# Altium schematic sheet RemoteControl.SchDoc
size A3; SheetNumber: 1; SheetTotal: 1
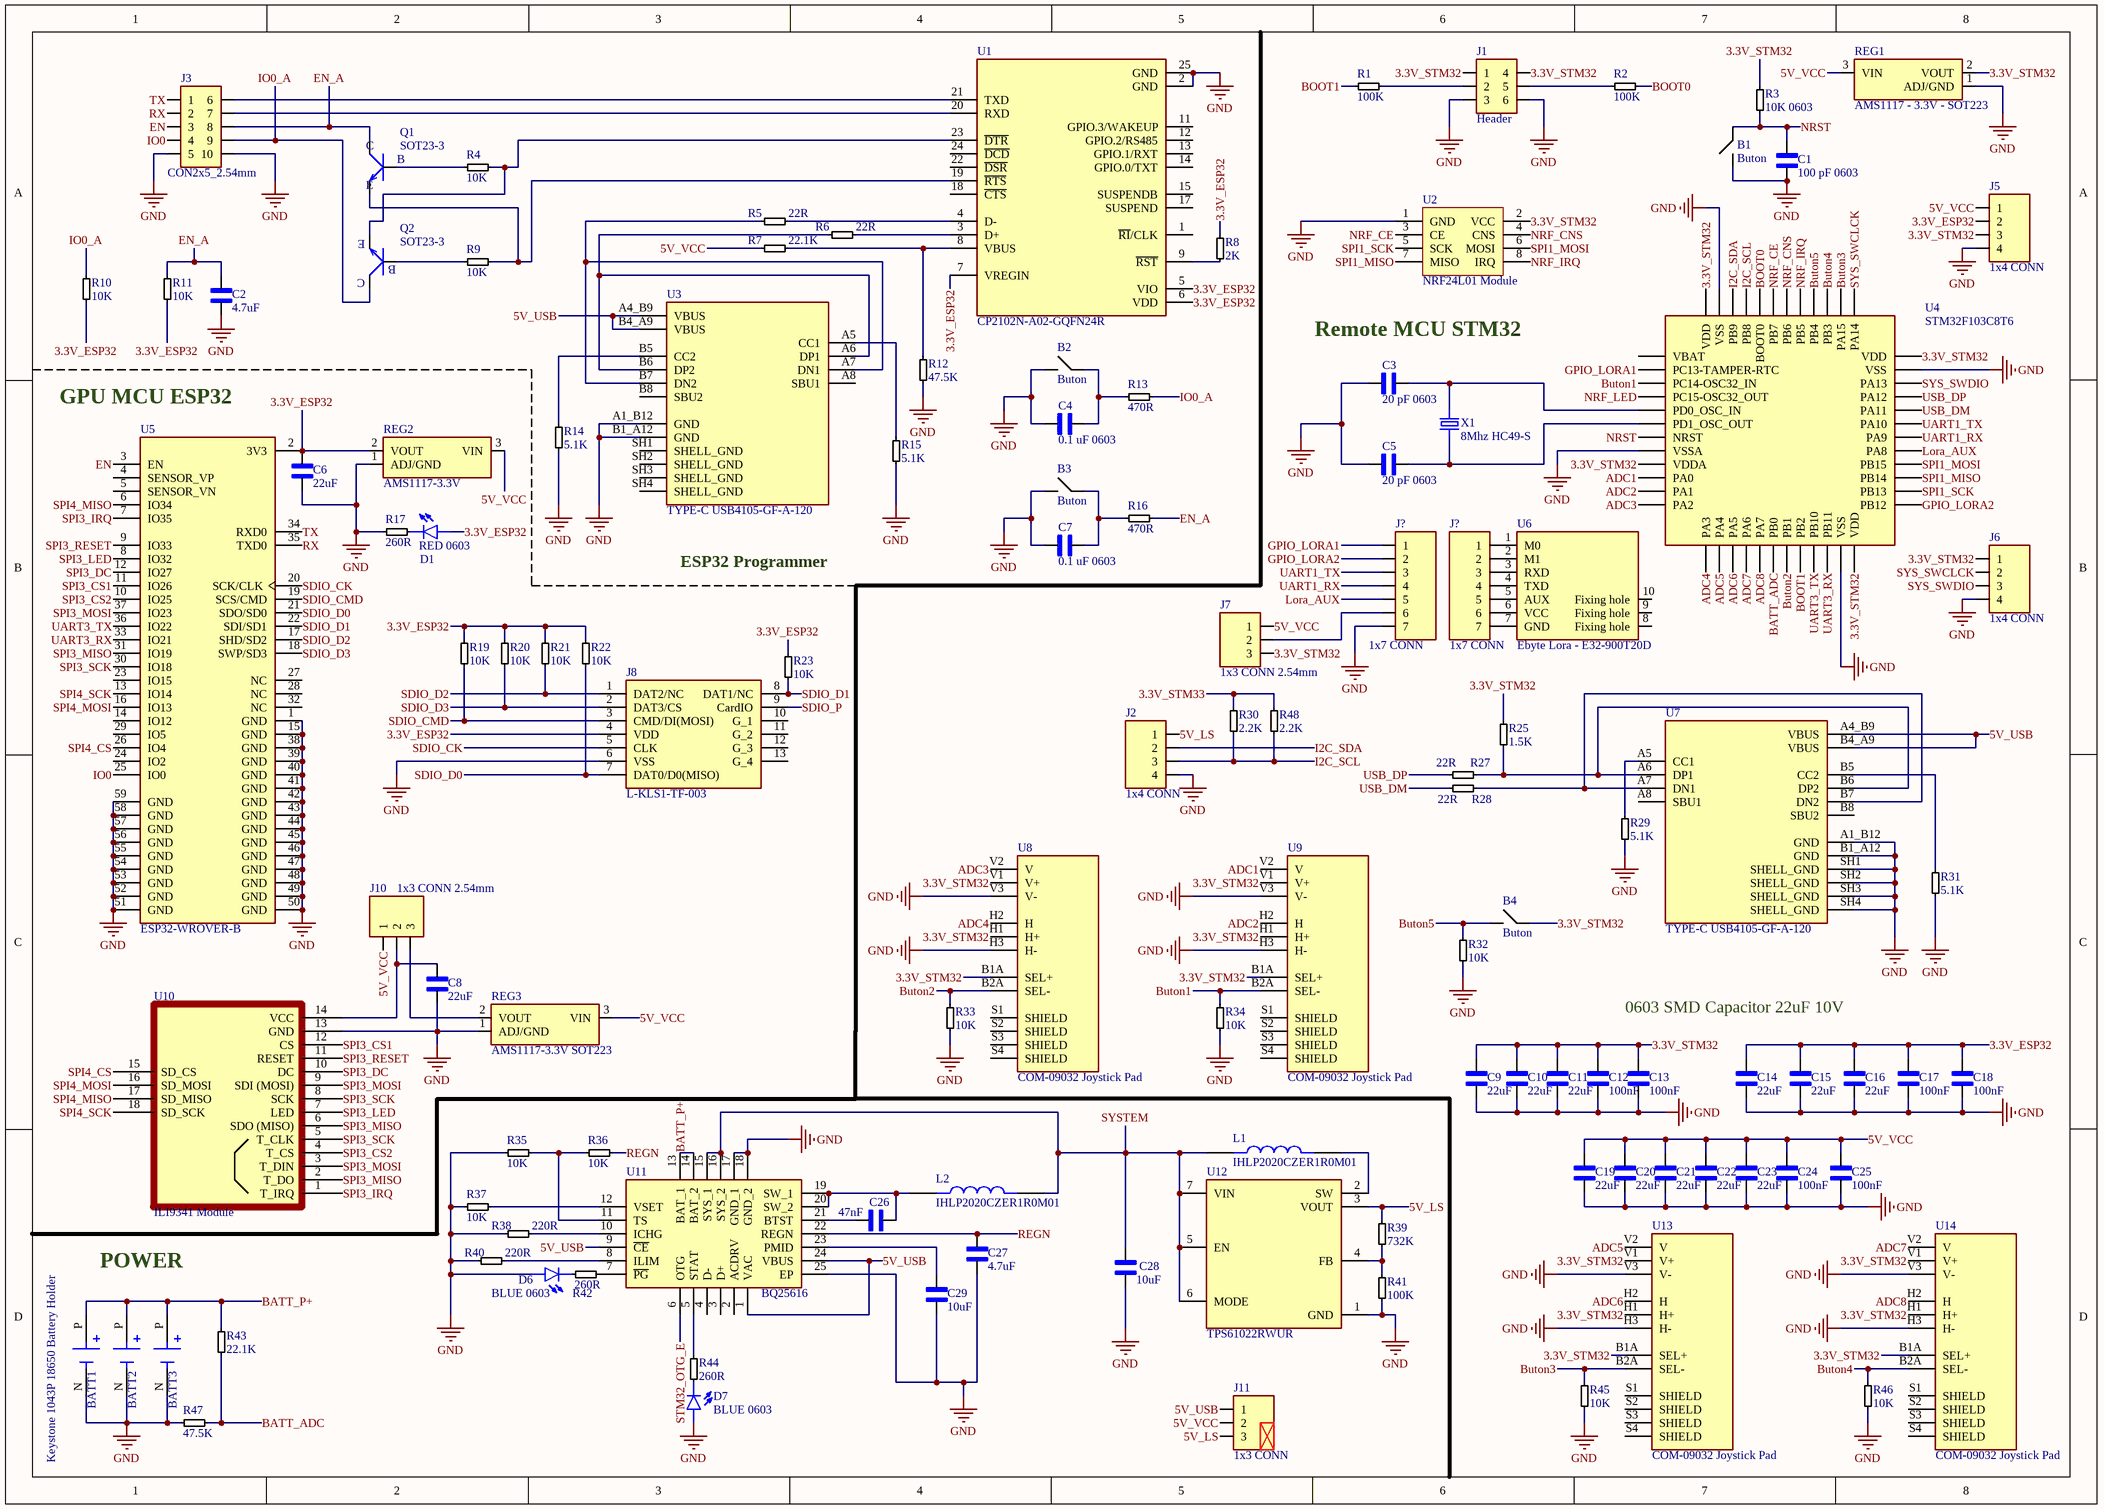
[diagram p0: RemoteControl.SchDoc]

## Parts
(Parts that share a designator on the sheet are numbered #1, #2 ... from top to bottom, then left to right.)
B1  Buton  [SMD TACT SWITCH BUTTON]
B2  Buton  [SMD TACT SWITCH BUTTON]
B3  Buton  [SMD TACT SWITCH BUTTON]
B4  Buton  [SMD TACT SWITCH BUTTON]
BATT1  Keystone 1043P 18650 Battery Holder  [1043P]
BATT2  Keystone 1043P 18650 Battery Holder  [1043P]  (value not drawn)
BATT3  Keystone 1043P 18650 Battery Holder  [1043P]  (value not drawn)
C1  100 pF 0603  [0603 SMD CAP]
C2  4.7uF  [0603 SMD CAP]
C3  20 pF 0603  [0603 SMD CAP]
C4  0.1 uF 0603  [0603 SMD CAP]
C5  20 pF 0603  [0603 SMD CAP]
C6  22uF  [0603 SMD CAP]
C7  0.1 uF 0603  [0603 SMD CAP]
C8  22uF  [0603 SMD CAP]
C9  22uF  [0603 SMD CAP]
C10  22uF  [0603 SMD CAP]
C11  22uF  [0603 SMD CAP]
C12  100nF  [0603 SMD CAP]
C13  100nF  [0603 SMD CAP]
C14  22uF  [0603 SMD CAP]
C15  22uF  [0603 SMD CAP]
C16  22uF  [0603 SMD CAP]
C17  100nF  [0603 SMD CAP]
C18  100nF  [0603 SMD CAP]
C19  22uF  [0603 SMD CAP]
C20  22uF  [0603 SMD CAP]
C21  22uF  [0603 SMD CAP]
C22  22uF  [0603 SMD CAP]
C23  22uF  [0603 SMD CAP]
C24  100nF  [0603 SMD CAP]
C25  100nF  [0603 SMD CAP]
C26  47nF  [0603 SMD CAP]
C27  4.7uF  [0603 SMD CAP]
C28  10uF  [0603 SMD CAP]
C29  10uF  [0603 SMD CAP]
D1  RED 0603  [0603 SMD LED]
D6  BLUE 0603  [0603 SMD LED]
D7  BLUE 0603  [0603 SMD LED]
J1  Header  [CON2x3_2.54MM]
J2  1x4 CONN  [CON1x4_2.54MM]
J3  CON2x5_2.54mm  [CON2x5_2.54MM]
J5  1x4 CONN  [CON1x4_2.54MM]
J6  1x4 CONN  [CON1x4_2.54MM]
J7  1x3 CONN 2.54mm  [CON1x3_2.54MM]
J8  L-KLS1-TF-003  [L-KLS1-TF-003-H1.85-R]
J10  1x3 CONN 2.54mm  [CON1x3_2.54MM]
J11  1x3 CONN  [CON1x3_2.54MM]
J?#1  1x7 CONN  [CON1x7_2.54MM]
J?#2  1x7 CONN  [CON1x7_2.54MM]
L1  IHLP2020CZER1R0M01  [IHLP2020CZER1R0M01]
L2  IHLP2020CZER1R0M01  [IHLP2020CZER1R0M01]
Q1  SOT23-3  [SOT23]
Q2  SOT23-3  [SOT23]
R1  100K  [0603 SMD RES]
R2  100K  [0603 SMD RES]
R3  10K 0603  [0603 SMD RES]
R4  10K  [0603 SMD RES]
R5  22R  [0603 SMD RES]
R6  22R  [0603 SMD RES]
R7  22.1K  [0603 SMD RES]
R8  2K  [0603 SMD RES]
R9  10K  [0603 SMD RES]
R10  10K  [0603 SMD RES]
R11  10K  [0603 SMD RES]
R12  47.5K  [0603 SMD RES]
R13  470R  [0603 SMD RES]
R14  5.1K  [0603 SMD RES]
R15  5.1K  [0603 SMD RES]
R16  470R  [0603 SMD RES]
R17  260R  [0603 SMD RES]
R19  10K  [0603 SMD RES]
R20  10K  [0603 SMD RES]
R21  10K  [0603 SMD RES]
R22  10K  [0603 SMD RES]
R23  10K  [0603 SMD RES]
R25  1.5K  [0603 SMD RES]
R27  22R  [0603 SMD RES]
R28  22R  [0603 SMD RES]
R29  5.1K  [0603 SMD RES]
R30  2.2K  [0603 SMD RES]
R31  5.1K  [0603 SMD RES]
R32  10K  [0603 SMD RES]
R33  10K  [0603 SMD RES]
R34  10K  [0603 SMD RES]
R35  10K  [0603 SMD RES]
R36  10K  [0603 SMD RES]
R37  10K  [0603 SMD RES]
R38  220R  [0603 SMD RES]
R39  732K  [0603 SMD RES]
R40  220R  [0603 SMD RES]
R41  100K  [0603 SMD RES]
R42  260R  [0603 SMD RES]
R43  22.1K  [0603 SMD RES]
R44  260R  [0603 SMD RES]
R45  10K  [0603 SMD RES]
R46  10K  [0603 SMD RES]
R47  47.5K  [0603 SMD RES]
R48  2.2K  [0603 SMD RES]
REG1  AMS1117 - 3.3V - SOT223  [SOT-223]
REG2  AMS1117-3.3V  [SOT-223]
REG3  AMS1117-3.3V SOT223  [SOT-223]
U1  CP2102N-A02-GQFN24R  [CP2102N-A02-GQFN24R]
U2  NRF24L01 Module  [NRF24L01 MODULE]
U3  TYPE-C USB4105-GF-A-120  [TYPE-C USB4105-GF-A-120]
U4  STM32F103C8T6  [LQFP-48]
U5  ESP32-WROVER-B  [ESP32-WROVER-B]
U6  Ebyte Lora - E32-900T20D  [Ebyte LoRa Modul]
U7  TYPE-C USB4105-GF-A-120  [TYPE-C USB4105-GF-A-120]
U8  COM-09032 Joystick Pad  [XDCR_COM-09032]
U9  COM-09032 Joystick Pad  [XDCR_COM-09032]
U10  ILI9341 Module  [ILI9341 2.8" Pitch]
U11  BQ25616  [WQFN-24]
U12  TPS61022RWUR  [TPS61022RWUR]
U13  COM-09032 Joystick Pad  [XDCR_COM-09032]
U14  COM-09032 Joystick Pad  [XDCR_COM-09032]
X1  8Mhz HC49-S  [HC49-S Crystal Oscillator]

## Nets
GND: B1.0 B2.0 B3.0 BATT1.N(NEG) BATT2.N(NEG) BATT3.N(NEG) C1.2 C2.2 C3.2 C4.2 C5.2 C6.2 C7.2 C8.2 C9.2 C10.2 C11.2 C12.2 C13.2 C14.2 C15.2 C16.2 C17.2 C18.2 C19.2 C20.2 C21.2 C22.2 C23.2 C24.2 C25.2 C27.2 C28.2 C29.1 D6.A D7.A J1.3 J1.6 J2.4 J3.5 J3.10 J5.4 J6.4 J8.6(VSS) J?#1.7 R12.1 R14.1 R15.1 R17.2 R29.1 R31.1 R32.1 R33.2 R34.2 R35.2 R37.2 R38.1 R40.1 R41.2 R45.2 R46.2 R47.2 REG1.1(ADJ/GND) REG2.1(ADJ/GND) REG3.1(ADJ/GND) U1.2(GND) U1.25(GND) U2.1(GND) U3.A1_B12(GND) U3.B1_A12(GND) U4.8(VSSA) U4.23(VSS) U4.35(VSS) U4.47(VSS) U5.1(GND) U5.15(GND) U5.38(GND) U5.39(GND) U5.40(GND) U5.41(GND) U5.42(GND) U5.43(GND) U5.44(GND) U5.45(GND) U5.46(GND) U5.47(GND) U5.48(GND) U5.49(GND) U5.50(GND) U5.51(GND) U5.52(GND) U5.53(GND) U5.54(GND) U5.55(GND) U5.56(GND) U5.57(GND) U5.58(GND) U5.59(GND) U7.A1_B12(GND) U7.B1_A12(GND) U7.SH1(SHELL_GND) U7.SH2(SHELL_GND) U7.SH3(SHELL_GND) U7.SH4(SHELL_GND) U8.H3(H-) U8.V3(V-) U9.H3(H-) U9.V3(V-) U10.13(GND) U11.17(GND_1) U11.18(GND_2) U11.25(EP) U12.1(GND) U13.H3(H-) U13.V3(V-) U14.H3(H-) U14.V3(V-)
3.3V_ESP32: C6.1 C14.1 C15.1 C16.1 C17.1 C18.1 D1.A J5.2 J8.4(VDD) R8.2 R10.1 R11.1 R19.2 R20.2 R21.2 R22.2 R23.1 REG2.2(VOUT) U1.5(VIO) U1.6(VDD) U1.7(VREGIN) U5.2(3V3)
3.3V_STM32: B4.1 C9.1 C10.1 C11.1 C12.1 C13.1 J1.1 J1.4 J5.3 J6.1 J7.3 R3.1 R25.2 REG1.2(VOUT) U2.2(VCC) U4.9(VDDA) U4.24(VDD) U4.36(VDD) U4.48(VDD) U8.B1A(SEL+) U8.H1(H+) U8.V1(V+) U9.B1A(SEL+) U9.H1(H+) U9.V1(V+) U13.B1A(SEL+) U13.H1(H+) U13.V1(V+) U14.B1A(SEL+) U14.H1(H+) U14.V1(V+)
3.3V_STM33: R30.2 R48.2
5V_LS: J2.1 J11.3 R39.1 U12.3(VOUT)
5V_USB: J11.1 U3.A4_B9(VBUS) U3.B4_A9(VBUS) U7.A4_B9(VBUS) U7.B4_A9(VBUS) U11.1(VAC) U11.9(~{CE}) U11.24(VBUS)
5V_VCC: C19.1 C20.1 C21.1 C22.1 C23.1 C24.1 C25.1 J5.1 J7.1 J10.1 J11.2 R7.1 REG1.3(VIN) REG2.3(VIN) REG3.3(VIN)
ADC1: U4.10(PA0) U9.V2(V)
ADC2: U4.11(PA1) U9.H2(H)
ADC3: U4.12(PA2) U8.V2(V)
ADC4: U4.13(PA3) U8.H2(H)
ADC5: U4.14(PA4) U13.V2(V)
ADC6: U4.15(PA5) U13.H2(H)
ADC7: U4.16(PA6) U14.V2(V)
ADC8: U4.17(PA7) U14.H2(H)
BATT_ADC: R43.1 R47.1 U4.18(PB0)
BATT_P+: BATT1.P(POS) BATT2.P(POS) BATT3.P(POS) R43.2 U11.13(BAT_1) U11.14(BAT_2)
BOOT0: R2.2 U4.44(BOOT0)
BOOT1: R1.1 U4.20(PB2)
Buton1: R34.1 U4.3(PC14-OSC32_IN) U9.B2A(SEL-)
Buton2: R33.1 U4.19(PB1) U8.B2A(SEL-)
Buton3: R45.1 U4.38(PA15) U13.B2A(SEL-)
Buton4: R46.1 U4.39(PB3) U14.B2A(SEL-)
Buton5: B4.0 R32.2 U4.40(PB4)
EN: J3.3 U5.3(EN)
EN_A: C2.1 J3.8 Q1.3(C) R11.2 R16.2
GPIO_LORA1: J?#1.1 U4.2(PC13-TAMPER-RTC)
GPIO_LORA2: J?#1.2 U4.25(PB12)
I2C_SCL: J2.3 R30.1 R48.1 U4.45(PB8)
I2C_SDA: J2.2 U4.46(PB9)
IO0: J3.4 U5.25(IO0)
IO0_A: J3.9 Q2.3(C) R10.2 R13.2
Lora_AUX: J?#1.5 U4.29(PA8)
NRF_CE: U2.3(CE) U4.43(PB7)
NRF_CNS: U2.4(CNS) U4.42(PB6)
NRF_IRQ: U2.8(IRQ) U4.41(PB5)
NRF_LED: U4.4(PC15-OSC32_OUT)
NRST: B1.1 C1.1 R3.2 U4.7(NRST)
REGN: C27.1 R36.2 U11.22(REGN)
RX: J3.2 U5.35(TXD0)
SDIO_CK: J8.5(CLK) U5.20(SCK/CLK)
SDIO_CMD: J8.3(CMD/DI(MOSI)) R19.1 U5.19(SCS/CMD)
SDIO_D0: J8.7(DAT0/D0(MISO)) R22.1 U5.21(SDO/SD0)
SDIO_D1: J8.8(DAT1/NC) R23.2 U5.22(SDI/SD1)
SDIO_D2: J8.1(DAT2/NC) R21.1 U5.17(SHD/SD2)
SDIO_D3: J8.2(DAT3/CS) R20.1 U5.18(SWP/SD3)
SDIO_P: J8.9(CardIO)
SPI1_MISO: U2.7(MISO) U4.27(PB14)
SPI1_MOSI: U2.6(MOSI) U4.28(PB15)
SPI1_SCK: U2.5(SCK) U4.26(PB13)
SPI3_CS1: U5.11(IO26) U10.12(CS)
SPI3_CS2: U5.10(IO25) U10.4(T_CS)
SPI3_DC: U5.12(IO27) U10.10(DC)
SPI3_IRQ: U5.7(IO35) U10.1(T_IRQ)
SPI3_LED: U5.8(IO32) U10.7(LED)
SPI3_MISO: U5.31(IO19) U10.2(T_DO) U10.6(SDO_(MISO))
SPI3_MOSI: U5.37(IO23) U10.3(T_DIN) U10.9(SDI_(MOSI))
SPI3_RESET: U5.9(IO33) U10.11(RESET)
SPI3_SCK: U5.30(IO18) U10.5(T_CLK) U10.8(SCK)
SPI4_CS: U5.26(IO4) U10.15(SD_CS)
SPI4_MISO: U5.6(IO34) U10.17(SD_MISO)
SPI4_MOSI: U5.16(IO13) U10.16(SD_MOSI)
SPI4_SCK: U5.13(IO14) U10.18(SD_SCK)
STM32_OTG_E: U11.6(OTG)
SYS_SWCLCK: J6.2 U4.37(PA14)
SYS_SWDIO: J6.3 U4.34(PA13)
SYSTEM: C28.1 L1.1 L2.2 U11.15(SYS_1) U11.16(SYS_2) U12.5(EN) U12.6(MODE) U12.7(VIN)
TX: J3.1 U5.34(RXD0)
UART1_RX: J?#1.4 U4.30(PA9)
UART1_TX: J?#1.3 U4.31(PA10)
UART3_RX: U4.22(PB11) U5.33(IO21)
UART3_TX: U4.21(PB10) U5.36(IO22)
USB_DM: R28.1 U4.32(PA11)
USB_DP: R27.1 U4.33(PA12)
NetB2_1: B2.1 C4.1 R13.1
NetB3_1: B3.1 C7.1 R16.1
NetC3_1: C3.1 U4.5(PD0_OSC_IN) X1.2
NetC5_1: C5.1 U4.6(PD1_OSC_OUT) X1.1
NetC8_1: C8.1 J10.2 U10.14(VCC)
NetC26_1: C26.1 U11.21(BTST)
NetC26_2: C26.2 L2.1 U11.19(SW_1) U11.20(SW_2)
NetC29_2: C29.2 U11.23(PMID)
NetD1_C: D1.C R17.1
NetD6_C: D6.C R42.1
NetD7_C: D7.C R44.1
NetJ1_2: J1.2 R1.2
NetJ1_5: J1.5 R2.1
NetJ3_6: J3.6 U1.21(TXD)
NetJ3_7: J3.7 U1.20(RXD)
NetJ7_2: J7.2 J?#1.6
NetJ10_3: J10.3 REG3.2(VOUT)
NetJ?#2_1: J?#2.1 U6.1(M0)
NetJ?#2_2: J?#2.2 U6.2(M1)
NetJ?#2_3: J?#2.3 U6.3(RXD)
NetJ?#2_4: J?#2.4 U6.4(TXD)
NetJ?#2_5: J?#2.5 U6.5(AUX)
NetJ?#2_6: J?#2.6 U6.6(VCC)
NetJ?#2_7: J?#2.7 U6.7(GND)
NetL1_2: L1.2 U12.2(SW)
NetQ1_1: Q1.1(B) R4.1
NetQ1_2: Q1.2(E) R9.2 U1.19(~{RTS})
NetQ2_1: Q2.1(B) R9.1
NetQ2_2: Q2.2(E) R4.2 U1.23(~{DTR})
NetR5_1: R5.1 U3.A7(DN1) U3.B7(DN2)
NetR5_2: R5.2 U1.4(D-)
NetR6_1: R6.1 U3.A6(DP1) U3.B6(DP2)
NetR6_2: R6.2 U1.3(D+)
NetR7_2: R7.2 R12.2 U1.8(VBUS)
NetR8_1: R8.1 U1.9(~{RST})
NetR14_2: R14.2 U3.B5(CC2)
NetR15_2: R15.2 U3.A5(CC1)
NetR25_1: R25.1 R27.2 U7.A6(DP1) U7.B6(DP2)
NetR28_2: R28.2 U7.A7(DN1) U7.B7(DN2)
NetR29_2: R29.2 U7.A5(CC1)
NetR31_2: R31.2 U7.B5(CC2)
NetR35_1: R35.1 R36.1 U11.11(TS)
NetR37_1: R37.1 U11.12(VSET)
NetR38_2: R38.2 U11.10(ICHG)
NetR39_2: R39.2 R41.1 U12.4(FB)
NetR40_2: R40.2 U11.8(ILIM)
NetR42_2: R42.2 U11.7(~{PG})
NetR44_2: R44.2 U11.5(STAT)

Not connected (* = marked no-connect by the designer): J8 10(G_1) 11(G_2) 12(G_3) 13(G_4); U1 1(~{RI}/CLK) 11(GPIO.3/WAKEUP) 12(GPIO.2/RS485) 13(GPIO.1/RXT) 14(GPIO.0/TXT) 15(SUSPENDB) 17(SUSPEND) 18(~{CTS}) 22(~{DSR}) 24(~{DCD}); U3 A8(SBU1) B8(SBU2) SH1(SHELL_GND) SH2(SHELL_GND) SH3(SHELL_GND) SH4(SHELL_GND); U4 1(VBAT); U5 4(SENSOR_VP) 5(SENSOR_VN) 14(IO12) 23(IO15) 24(IO2) 27(NC) 28(NC) 29(IO5) 32(NC); U6 8(Fixing_hole) 9(Fixing_hole) 10(Fixing_hole); U7 A8(SBU1) B8(SBU2); U8 S1(SHIELD) S2(SHIELD) S3(SHIELD) S4(SHIELD); U9 S1(SHIELD) S2(SHIELD) S3(SHIELD) S4(SHIELD); U11 2(ACDRV) 3(D+) 4(D-); U13 S1(SHIELD) S2(SHIELD) S3(SHIELD) S4(SHIELD); U14 S1(SHIELD) S2(SHIELD) S3(SHIELD) S4(SHIELD)

## Notes on the sheet
- Remote MCU STM32
- (near U5) GPU MCU ESP32
- ESP32 Programmer
- 0603 SMD Capacitor 22uF 10V
- POWER

## Library data of the parts
B1-B4 = SMD TACT SWITCH BUTTON
BATT1-BATT3 = 1043P 18650 Battery Holder
C1-C29 = CAP SMD 603
D1 D6 D7 = LED 603 SMD
J1 = CON2x3_2.54mm
J2 J5 J6 = CON1x4_2.54mm
J7 J10 J11 = CON1x3_2.54mm
J8 = L-KLS1-TF-003-H1.85-R
J?#1 J?#2 = CON1x7_2.54mm
Q1 Q2 = S8050 BJT NPN: Bipolar (BJT) Transistor NPN 25 V 500 mA 150MHz 300 mW Surface Mount SOT-23N
R1-R17 R19-R23 R25 R27-R48 = RES SMD 0603
REG1-REG3 = AMS1117
U6 = Ebyte Lora
U8 U9 U13 U14 = COM-09032
X1 = HC49-S Crystal Oscillator